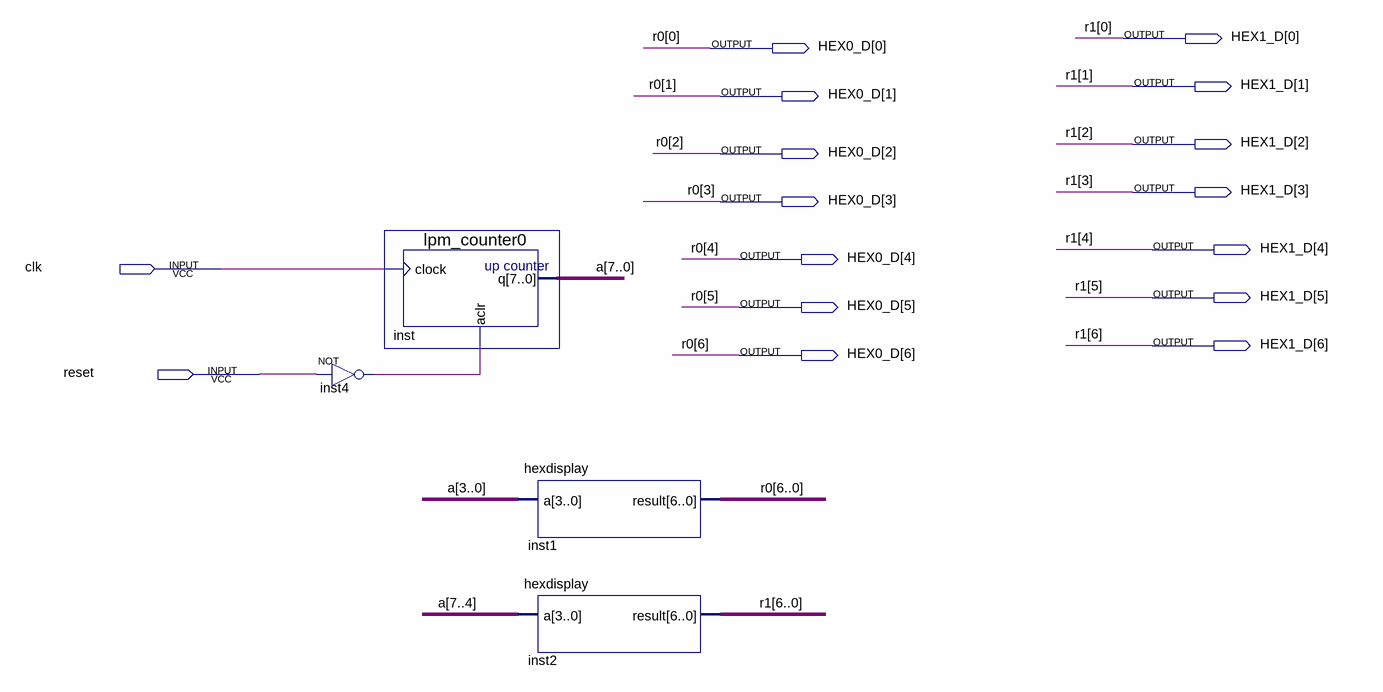
[diagram p0: schematic sheet]
// Quartus schematic task1.bdf as structural Verilog: 4 symbols, 16 pins
module task1 (
  input  clk,
  input  reset,
  output [6:0] HEX1_D,
  output [6:0] HEX0_D
);

  wire inst4_out;
  wire [7:0] a;

  not inst4 (inst4_out, reset);
  lpm_counter0 inst (.clock(clk), .aclr(inst4_out), .q(a));
  hexdisplay inst1 (.a(a[3:0]), .result(HEX0_D));
  hexdisplay inst2 (.a(a[7:4]), .result(HEX1_D));

  // Other names for the same wires on the sheet: r0[6:0] = HEX0_D; r1[6:0] = HEX1_D
endmodule
